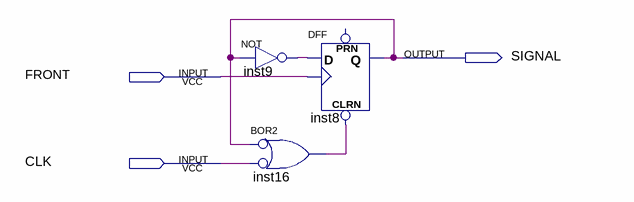
[diagram p0: schematic sheet]
// Quartus schematic FRONT_TO_SIGNAL.bdf as structural Verilog: 3 symbols, 3 pins
module FRONT_TO_SIGNAL (
  input  FRONT,
  input  CLK,
  output SIGNAL
);

  wire inst9_out, inst16_out;

  DFF inst8 (.CLRN(inst16_out), .CLK(FRONT), .D(inst9_out), .Q(SIGNAL));  // open: PRN
  not inst9 (inst9_out, SIGNAL);
  or inst16 (inst16_out, ~SIGNAL, ~CLK);  // BOR2
endmodule
